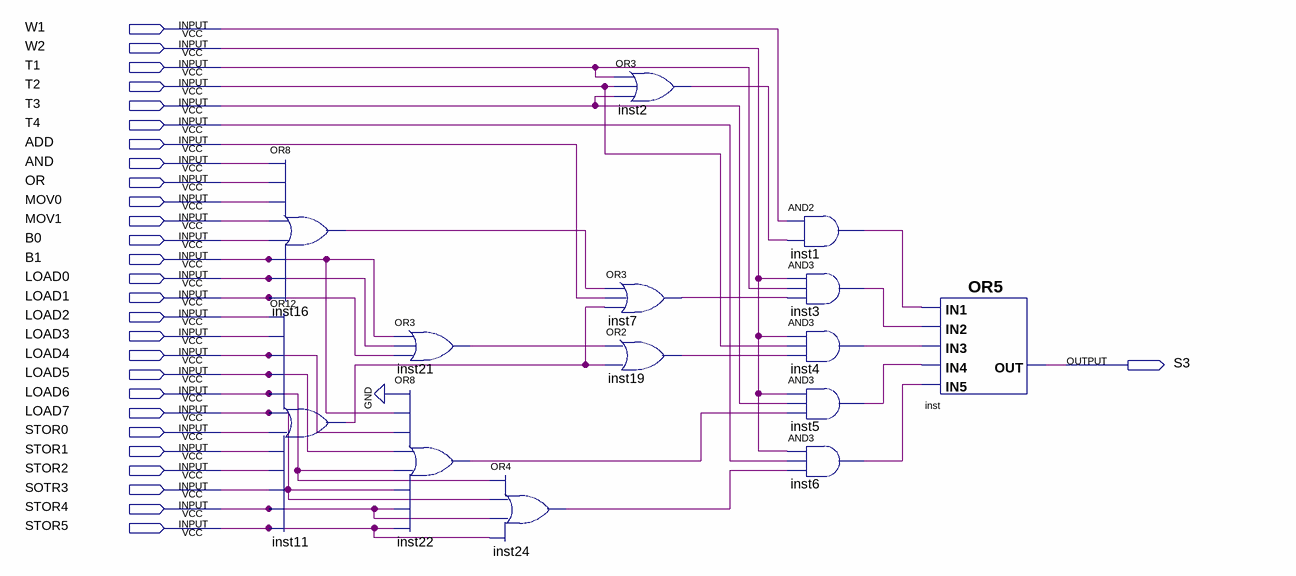
[diagram p0: schematic sheet]
// Quartus schematic S3.bdf as structural Verilog: 14 symbols, 28 pins
module S3 (
  input  W1,
  input  W2,
  input  T1,
  input  T2,
  input  T3,
  input  T4,
  input  ADD,
  input  AND,
  input  OR,
  input  MOV0,
  input  MOV1,
  input  B0,
  input  B1,
  input  LOAD0,
  input  LOAD1,
  input  LOAD2,
  input  LOAD3,
  input  LOAD4,
  input  LOAD5,
  input  LOAD6,
  input  LOAD7,
  input  STOR0,
  input  STOR1,
  input  STOR2,
  input  SOTR3,
  input  STOR4,
  input  STOR5,
  output S3
);

  wire inst1_out, inst2_out, inst3_out, inst4_out, inst5_out, inst6_out, inst7_out, inst11_out, inst16_out,
       inst19_out, inst21_out, inst22_out, inst24_out;

  or inst16 (inst16_out, AND, OR, MOV0, MOV1, B0, B1, LOAD0, LOAD1);
  or inst11 (inst11_out, LOAD2, LOAD3, LOAD4, LOAD5, LOAD6, LOAD7, STOR0, STOR1, STOR2, SOTR3, STOR4, STOR5);
  or inst21 (inst21_out, B1, LOAD0, LOAD1);
  or inst22 (inst22_out, 1'b0, B1, LOAD4, LOAD5, LOAD6, LOAD7, STOR4, STOR5);
  or inst24 (inst24_out, LOAD6, LOAD7, STOR4, STOR5);
  or inst2 (inst2_out, T1, T2, T3);
  or inst7 (inst7_out, inst16_out, ADD, inst11_out);
  or inst19 (inst19_out, inst21_out, inst11_out);
  and inst1 (inst1_out, W1, inst2_out);
  and inst3 (inst3_out, W2, T1, inst7_out);
  and inst4 (inst4_out, W2, T2, inst19_out);
  and inst5 (inst5_out, W2, T3, inst22_out);
  and inst6 (inst6_out, W2, T4, inst24_out);
  or inst (S3, inst1_out, inst3_out, inst4_out, inst5_out, inst6_out);
endmodule
